# EAGLE schematic mosfet_cutoff (EAGLE 7.6.0)
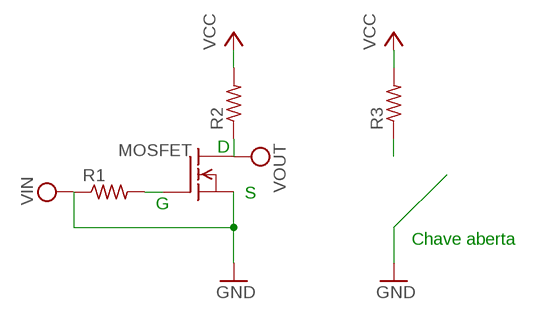
[diagram p0: schematic, sheet 1]

## Parts
MOSFET  BSS97  [TO202]
R1  R-US_0204/2V  [0204V]
R2  R-US_0204/2V  [0204V]
R3  R-US_0204/2V  [0204V]

## Nets
GND: MOSFET.1(S) R1.1
N$1: MOSFET.3(G) R1.2
N$2: MOSFET.2(D) R2.1
N$3: R3.1
VCC: R2.2 R3.2

## Notes on the sheet
- D
- ≡
- S
- G
- Chave aberta

## Library data of the parts
MOSFET = transistor-fet:BSS97: N-Channel Enhancement MOSFET 200V; 1.5A; 1,6Ohm
R1-R3 = rcl:R-US_: RESISTOR, American symbol